# Altium schematic sheet Sheet_1_2023-04-12.schdoc
size 278 x 199 mm
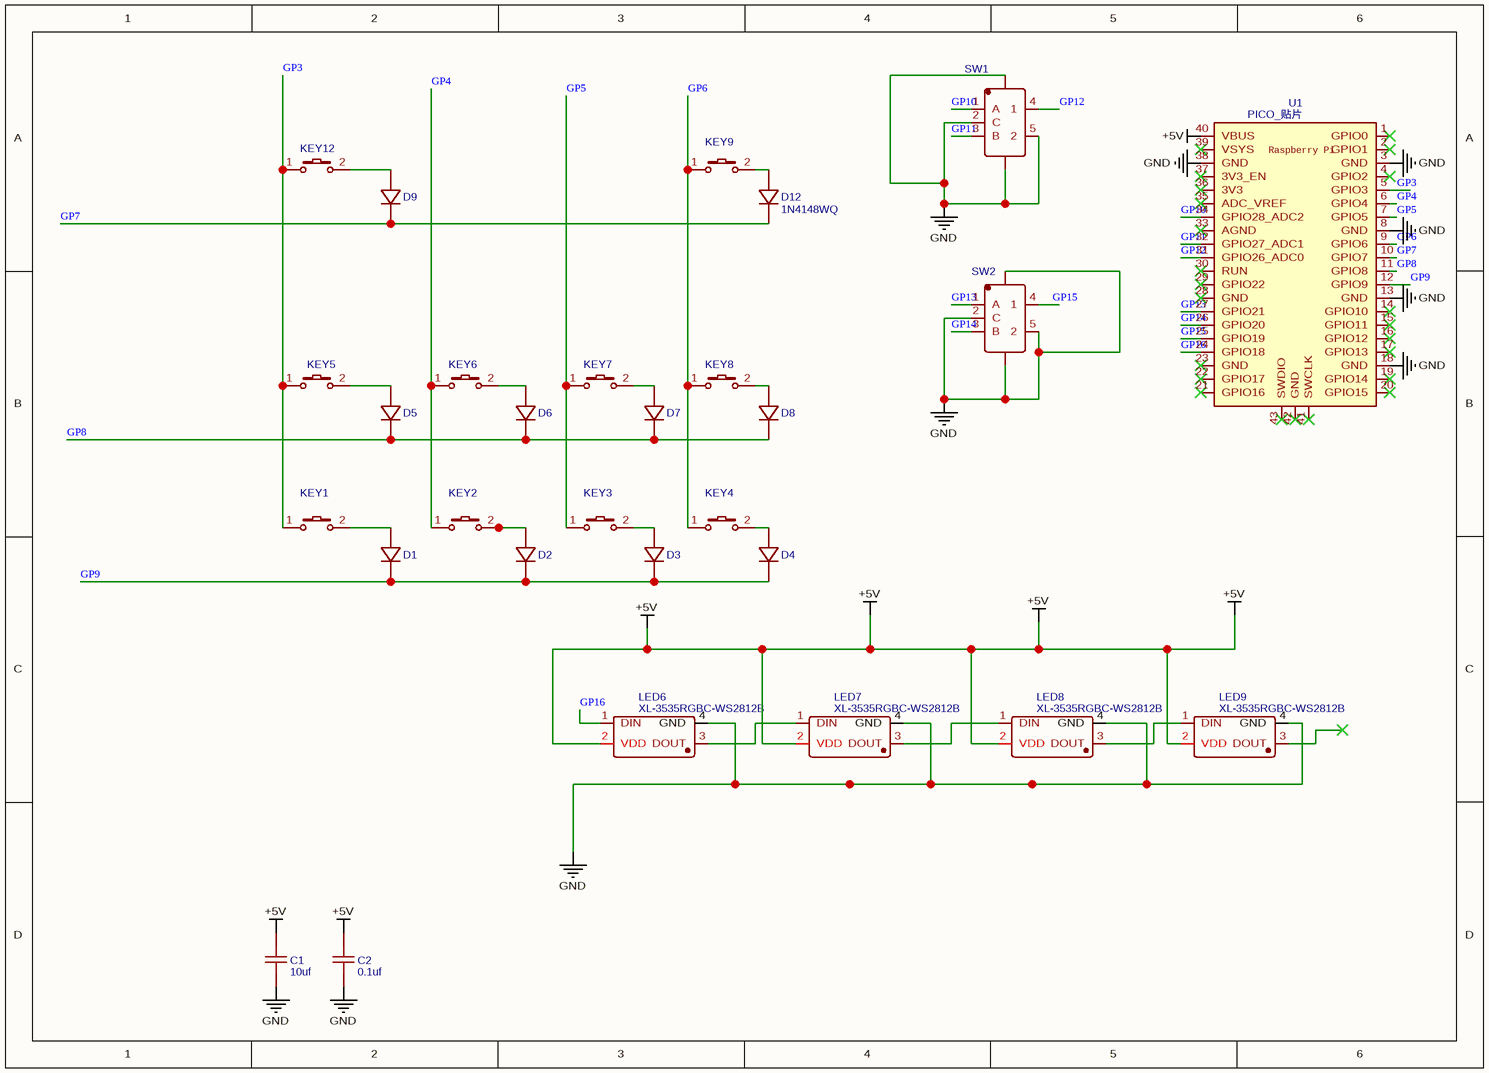
[diagram p0: Sheet_1_2023-04-12.schdoc]

## Parts
C1  10uf  [C0603]
C2  0.1uf  [C0603]
D1  1N4148WQ  [SOD-123_L2.7-W1.6-LS3.7-RD-1]  (value not drawn)
D2  1N4148WQ  [SOD-123_L2.7-W1.6-LS3.7-RD-1]  (value not drawn)
D3  1N4148WQ  [SOD-123_L2.7-W1.6-LS3.7-RD-1]  (value not drawn)
D4  1N4148WQ  [SOD-123_L2.7-W1.6-LS3.7-RD-1]  (value not drawn)
D5  1N4148WQ  [SOD-123_L2.7-W1.6-LS3.7-RD-1]  (value not drawn)
D6  1N4148WQ  [SOD-123_L2.7-W1.6-LS3.7-RD-1]  (value not drawn)
D7  1N4148WQ  [SOD-123_L2.7-W1.6-LS3.7-RD-1]  (value not drawn)
D8  1N4148WQ  [SOD-123_L2.7-W1.6-LS3.7-RD-1]  (value not drawn)
D9  1N4148WQ  [SOD-123_L2.7-W1.6-LS3.7-RD-1]  (value not drawn)
D12  1N4148WQ  [SOD-123_L2.7-W1.6-LS3.7-RD-1]
KEY1  K2-3.6×6.1_SMD  [KEY-TH_CPG1511F01S0X]  (value not drawn)
KEY2  K2-3.6×6.1_SMD  [KEY-TH_CPG1511F01S0X]  (value not drawn)
KEY3  K2-3.6×6.1_SMD  [KEY-TH_CPG1511F01S0X]  (value not drawn)
KEY4  K2-3.6×6.1_SMD  [KEY-TH_CPG1511F01S0X]  (value not drawn)
KEY5  K2-3.6×6.1_SMD  [KEY-TH_CPG1511F01S0X]  (value not drawn)
KEY6  K2-3.6×6.1_SMD  [KEY-TH_CPG1511F01S0X]  (value not drawn)
KEY7  K2-3.6×6.1_SMD  [KEY-TH_CPG1511F01S0X]  (value not drawn)
KEY8  K2-3.6×6.1_SMD  [KEY-TH_CPG1511F01S0X]  (value not drawn)
KEY9  K2-3.6×6.1_SMD  [KEY-TH_CPG1511F01S0X]  (value not drawn)
KEY12  K2-3.6×6.1_SMD  [KEY-TH_CPG1511F01S0X]  (value not drawn)
LED6  XL-3535RGBC-WS2812B  [LED-SMD_5050WS2812B]
LED7  XL-3535RGBC-WS2812B  [LED-SMD_5050WS2812B]
LED8  XL-3535RGBC-WS2812B  [LED-SMD_5050WS2812B]
LED9  XL-3535RGBC-WS2812B  [LED-SMD_5050WS2812B]
SW1  PEC11R-4215F-S0024  [SW-TH_5P-L12.5-W13.4-P2.50-LS14.5]  (value not drawn)
SW2  PEC11R-4215F-S0024  [SW-TH_5P-L12.5-W13.4-P2.50-LS14.5]  (value not drawn)
U1  PICO_贴片  [RPI_PICO_SMD_TH]

## Nets
+5V: C1.2 C2.2 LED6.2(VDD) LED7.2(VDD) LED8.2(VDD) LED9.2(VDD) U1.40(VBUS)
GND: C1.1 C2.1 LED6.4(GND) LED7.4(GND) LED8.4(GND) LED9.4(GND) SW1.2(C) SW1.5(2) SW1.7 SW1.8 SW2.2(C) SW2.5(2) SW2.7 SW2.8 U1.3(GND) U1.8(GND) U1.13(GND) U1.18(GND) U1.38(GND)
GP3: KEY1.1 KEY5.1 KEY12.1 U1.5(GPIO3)
GP4: KEY2.1 KEY6.1 U1.6(GPIO4)
GP5: KEY3.1 KEY7.1 U1.7(GPIO5)
GP6: KEY4.1 KEY8.1 KEY9.1 U1.9(GPIO6)
GP7: D9.1(K) D12.1(K) U1.10(GPIO7)
GP8: D5.1(K) D6.1(K) D7.1(K) D8.1(K) U1.11(GPIO8)
GP9: D1.1(K) D2.1(K) D3.1(K) D4.1(K) U1.12(GPIO9)
GP10: SW1.1(A) U1.34(GPIO28_ADC2)
GP11: SW1.3(B) U1.32(GPIO27_ADC1)
GP12: SW1.4(1) U1.31(GPIO26_ADC0)
GP13: SW2.1(A) U1.27(GPIO21)
GP14: SW2.3(B) U1.26(GPIO20)
GP15: SW2.4(1) U1.25(GPIO19)
GP16: LED6.1(DIN) U1.24(GPIO18)
NetD1_2: D1.2(A) KEY1.2
NetD2_2: D2.2(A) KEY2.2
NetD3_2: D3.2(A) KEY3.2
NetD4_2: D4.2(A) KEY4.2
NetD5_2: D5.2(A) KEY5.2
NetD6_2: D6.2(A) KEY6.2
NetD7_2: D7.2(A) KEY7.2
NetD8_2: D8.2(A) KEY8.2
NetD9_2: D9.2(A) KEY12.2
NetD12_2: D12.2(A) KEY9.2
NetLED6_3: LED6.3(DOUT) LED7.1(DIN)
NetLED7_3: LED7.3(DOUT) LED8.1(DIN)
NetLED8_3: LED8.3(DOUT) LED9.1(DIN)

Not connected (* = marked no-connect by the designer): LED9 3(DOUT)*; U1 1(GPIO0)* 2(GPIO1)* 4(GPIO2)* 14(GPIO10)* 15(GPIO11)* 16(GPIO12)* 17(GPIO13)* 19(GPIO14)* 20(GPIO15)* 21(GPIO16)* 22(GPIO17)* 23(GND)* 28(GND)* 29(GPIO22)* 30(RUN)* 33(AGND)* 35(ADC_VREF)* 36(3V3)* 37(3V3_EN)* 39(VSYS)* 41(SWCLK)* 42(GND)* 43(SWDIO)*

## Notes on the sheet
- (in symbol PICO_贴片) Raspberry Pi

## Library data of the parts
C1 = 10uf: nameAlias: Value(F); Contributor: LCEDA_Lib; spicePre: C; spiceSymbolName: C_0603_US
C2 = 0.1uf: nameAlias: Value(F); Contributor: LCEDA_Lib; spicePre: C; spiceSymbolName: C_0603_US
D1-D9 D12 = 1N4148WQ: BOM_Manufacturer: YANGJIE(扬杰); Contributor: lcsc; BOM_Supplier: LCSC; BOM_Supplier Part: C2942441; BOM_Manufacturer Part: 1N4148WQ; BOM_JLCPCB Part Class: Extended Part; spicePre: D; spiceSymbolName: 1N4148WQ
KEY1-KEY9 KEY12 = K2-3.6×6.1_SMD: BOM_Manufacturer Part: K2-1107ST-A4SW-06; Contributor: LCEDA_Lib; 制造商: 韩国韩荣; BOM_Supplier Part: C118141; BOM_Supplier: LCSC; spicePre: K; spiceSymbolName: K2-3.6×6.1_SMD
LED6-LED9 = XL-3535RGBC-WS2812B: BOM_Manufacturer: XINGLIGHT(成兴光); Contributor: LCSC; BOM_Supplier: LCSC; BOM_Supplier Part: C2843786; BOM_Manufacturer Part: XL-3535RGBC-WS2812B; BOM_JLCPCB Part Class: Extended Part; spicePre: L; spiceSymbolName: XL-3535RGBC-WS2812B
SW1 SW2 = PEC11R-4215F-S0024: BOM_Manufacturer: BOURNS; Contributor: LCSC; BOM_Supplier: LCSC; BOM_Supplier Part: C143790; BOM_Manufacturer Part: PEC11R-4215F-S0024; BOM_JLCPCB Part Class: Extended Part; spicePre: S; spiceSymbolName: PEC11R-4215F-S0024
U1 = PICO_贴片: Contributor: NicolassZuo; spicePre: U; spiceSymbolName: PICO_贴片